# EasyEDA schematic SCH_timer555_2026-08-26.json
TITLE: timer555 Astable Multivibrator; REV: 1.0; Date: 2026-08-25; Sheet: 1/1; Drawn By: sherif.os.abdelkareem; Company: syntaxIoT
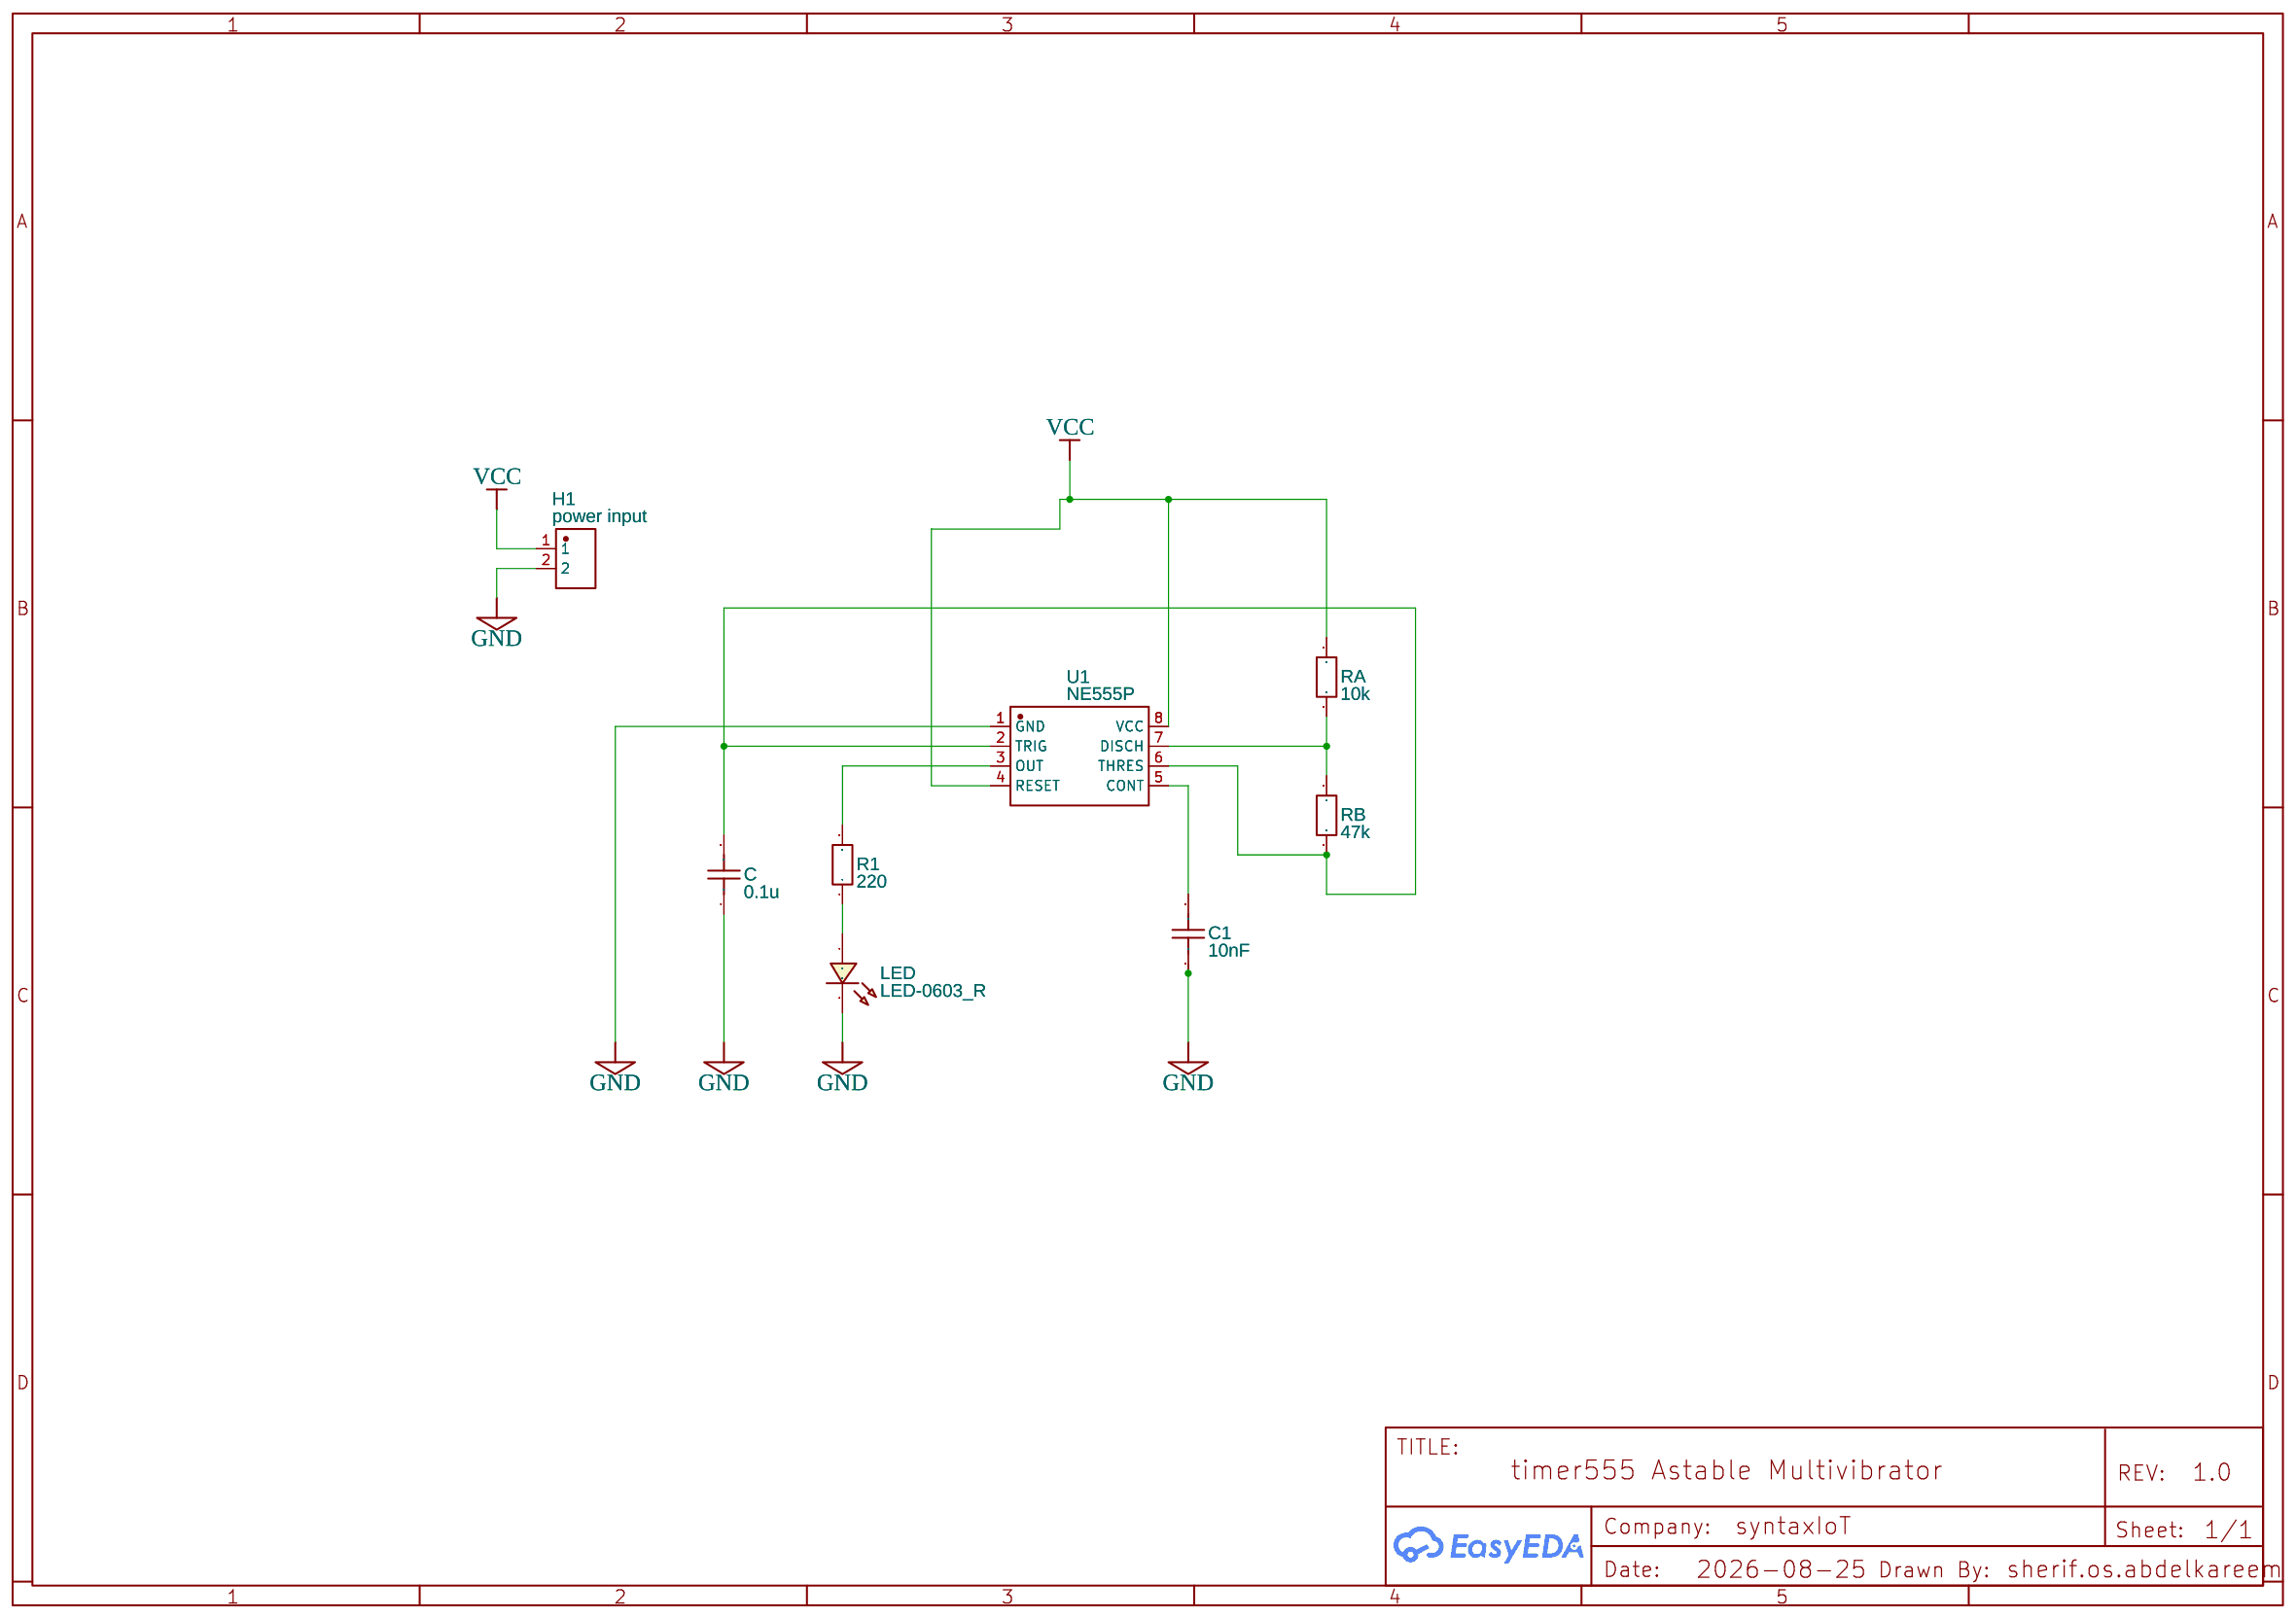
[diagram p0: schematic sheet]

## Parts
C  0.1u  [C0603]
C1  10nF  [C0603]
H1  power input  [HDR-TH_PZ-2.54-1X02-8.5-WZ]
LED  LED-0603_R  [LED0603_RED]
R1  220  [R0603]
RA  10k  [R0603]
RB  47k  [R0603]
U1  NE555P  [DIP-8_L9.8-W6.6-P2.54-LS7.6-BL]

## Library data of the parts
C C1 = C_0603_US: Contributor: LCEDA_Lib
H1 = PZ-2.54-1*02-8.5-WZ: Supplier: LCSC; Supplier Part: C53207359; Manufacturer: BXCONN(宝讯); JLCPCB Part Class: Extended Part; Contributor: lcsc
LED = LED-0603_R: Manufacturer: EVERLIGHT(台湾亿光); Manufacturer Part: 19-217/R6C-AL1M2VY/3T; Supplier Part: C72044; Supplier: LCSC; Contributor: LCEDA_01
R1 RA RB = R_0603_EU: Contributor: LCEDA_Lib
U1 = NE555P: Supplier: LCSC; Manufacturer: TI(德州仪器); Supplier Part: C46749; JLCPCB Part Class: Extended Part

## Nets
GND: C.1 C1.2 H1.2 LED.2 U1.1(GND)
VCC: H1.1 RA.1 U1.4(RESET) U1.8(VCC)
Net-(C1-1): C1.1 U1.5(CONT)
Net-(C-2): C.2 RB.2 U1.2(TRIG) U1.6(THRES)
Net-(LED-1): LED.1 R1.1
Net-(R1-2): R1.2 U1.3(OUT)
Net-(RA-2): RA.2 RB.1 U1.7(DISCH)
